# Altium schematic sheet motor_driver.SchDoc
size A4
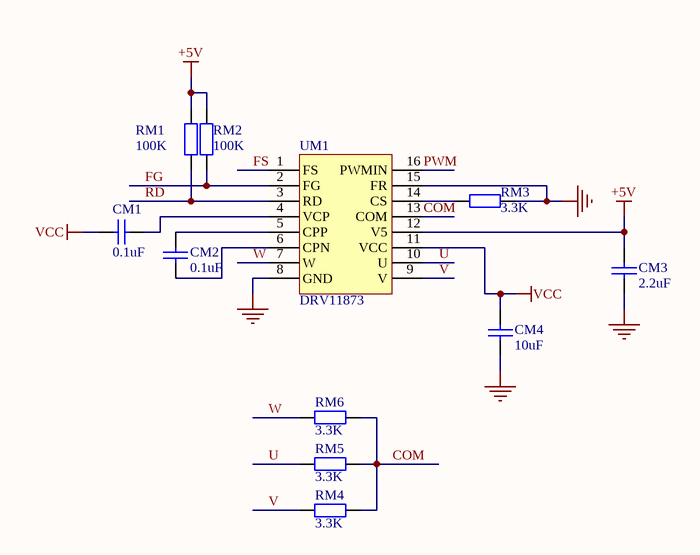
[diagram p0: motor_driver.SchDoc]

## Parts
CM1  value 0.1uF  [CAPC1608N]  (hidden comment: Cap1)
CM2  value 0.1uF  [CAPC1608N]  (hidden comment: Cap1)
CM3  value 2.2uF  [CAPC1608N]  (hidden comment: Cap1)
CM4  value 10uF  [CAPC1608N]  (hidden comment: Cap1)
RM1  value 100K  [RESC1608N]  (hidden comment: Res1)
RM2  value 100K  [RESC1608N]  (hidden comment: Res1)
RM3  value 3.3K  [RESC1608N]  (hidden comment: Res1)
RM4  value 3.3K  [RESC1608N]  (hidden comment: Res1)
RM5  value 3.3K  [RESC1608N]  (hidden comment: Res1)
RM6  value 3.3K  [RESC1608N]  (hidden comment: Res1)
UM1  DRV11873  [TSSOP-16N]

## Nets
+5V: CM3.1 RM1.2 RM2.2 UM1.12(V5)
GND: CM3.2 CM4.2 RM3.1 UM1.8(GND) UM1.15(FR)
VCC: CM1.2 CM4.1 UM1.11(VCC)
COM: RM4.2 RM5.2 RM6.2 UM1.13(COM)
FG: RM2.1 UM1.2(FG)
FS: UM1.1(FS)
PWM: UM1.16(PWMIN)
RD: RM1.1 UM1.3(RD)
U: RM5.1 UM1.10(U)
V: RM4.1 UM1.9(V)
W: RM6.1 UM1.7(W)
NetCM1_1: CM1.1 UM1.4(VCP)
NetCM2_1: CM2.1 UM1.5(CPP)
NetCM2_2: CM2.2 UM1.6(CPN)
NetRM3_2: RM3.2 UM1.14(CS)

## Library data of the parts
CM1-CM4 = Cap1: Capacitor; Published: 8-Jun-2000; LatestRevisionDate: 17-Jul-2002; LatestRevisionNote: Re-released for DXP Platform.; PackageReference: RAD-0.3; Publisher: Altium Limited
RM1-RM6 = Res1: Resistor; Published: 8-Jun-2000; LatestRevisionDate: 17-Jul-2002; LatestRevisionNote: Re-released for DXP Platform.; PackageReference: AXIAL-0.4; Publisher: Altium Limited
UM1 = DRV11873: 三相无传感器、 无刷直流 (BLDC) 电机驱动器